# Altium schematic sheet 音乐频谱分析仪2014-11-17.SchDoc
size A
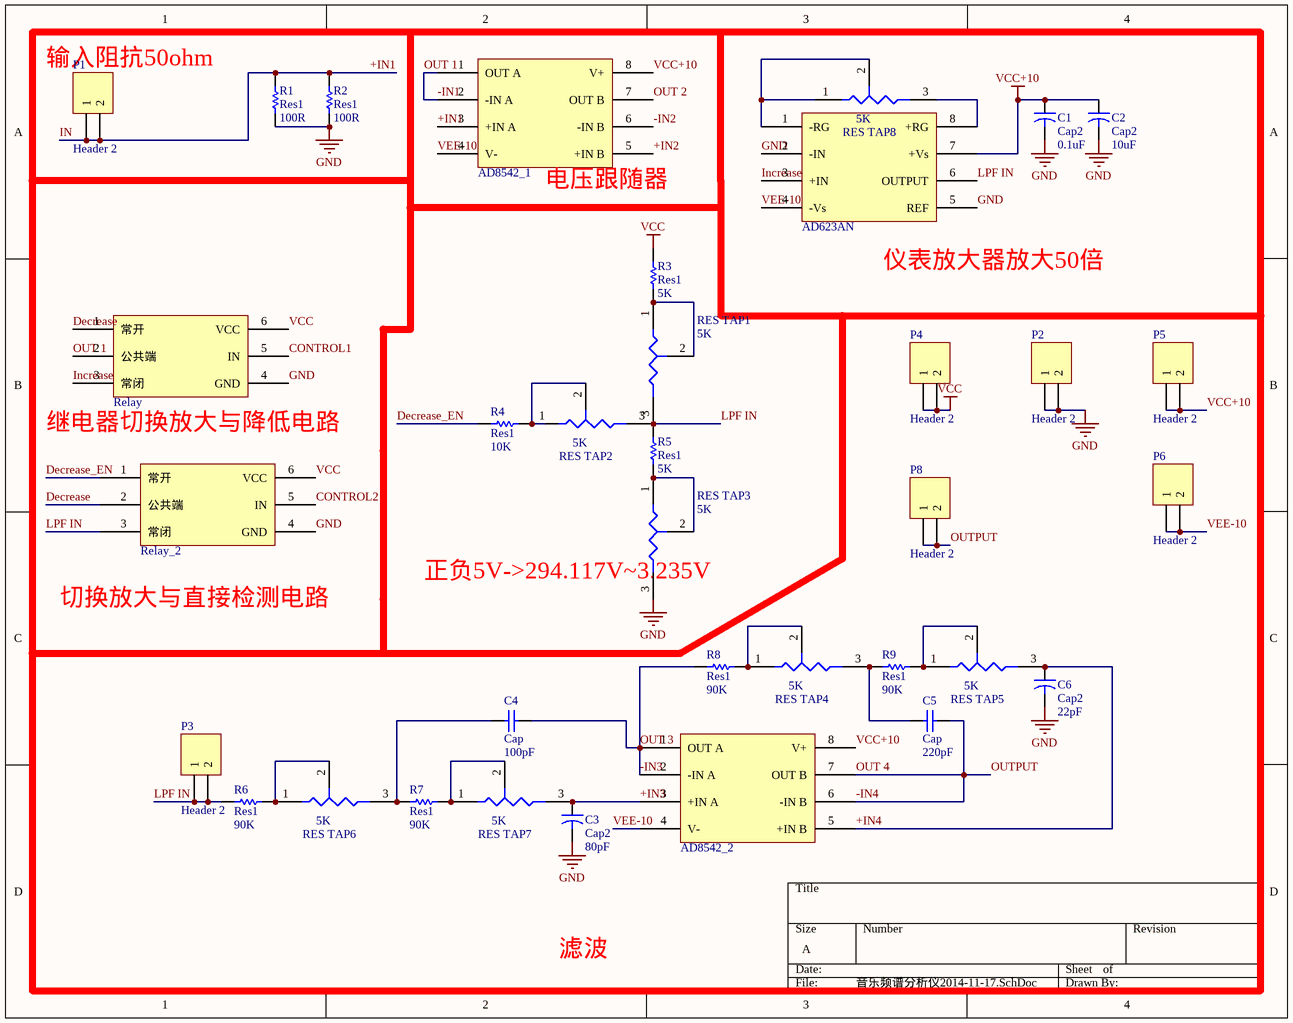
[diagram p0: 音乐频谱分析仪2014-11-17.SchDoc]

## Parts
AD623AN  AD623AN  [AD623AN]  (value not drawn)
AD8542_1  AD8542  [AD8542]  (value not drawn)
AD8542_2  AD8542  [AD8542]  (value not drawn)
C1  Cap2  value 0.1uF  [BAT-2]
C2  Cap2  value 10uF  [BAT-2]
C3  Cap2  value 80pF  [BAT-2]
C4  Cap  value 100pF  [BAT-2]
C5  Cap  value 220pF  [BAT-2]
C6  Cap2  value 22pF  [BAT-2]
P1  Header 2  [HDR1X2]
P2  Header 2  [HDR1X2]
P3  Header 2  [HDR1X2]
P4  Header 2  [HDR1X2]
P5  Header 2  [HDR1X2]
P6  Header 2  [HDR1X2]
P8  Header 2  [HDR1X2]
R1  Res1  value 100R  [AXIAL-0.3]
R2  Res1  value 100R  [AXIAL-0.3]
R3  Res1  value 5K  [AXIAL-0.3]
R4  Res1  value 10K  [AXIAL-0.3]
R5  Res1  value 5K  [AXIAL-0.3]
R6  Res1  value 90K  [AXIAL-0.3]
R7  Res1  value 90K  [AXIAL-0.3]
R8  Res1  value 90K  [AXIAL-0.3]
R9  Res1  value 90K  [AXIAL-0.3]
Relay  Relay  [Relay]  (value not drawn)
Relay_2  Relay  [Relay]  (value not drawn)
RES_TAP1  5K  [RES TAP2]
RES_TAP2  5K  [RES TAP2]
RES_TAP3  5K  [RES TAP2]
RES_TAP4  5K  [RES TAP2]
RES_TAP5  5K  [RES TAP2]
RES_TAP6  5K  [RES TAP2]
RES_TAP7  5K  [RES TAP2]
RES_TAP8  5K  [RES TAP2]

## Nets
GND: AD623AN.2(-IN) AD623AN.5(REF) C1.2 C2.2 C3.2 C6.2 P2.1 P2.2 R1.1 R2.1 Relay.4(GND) Relay_2.4(GND) RES_TAP3.3(B)
VCC: P4.1 P4.2 R3.2 Relay.6(VCC) Relay_2.6(VCC)
VCC+10: AD623AN.7(+Vs) AD8542_1.8(V+) AD8542_2.8(V+) C1.1 C2.1 P5.1 P5.2
+IN1: AD8542_1.3(+IN_A) P1.1 P1.2 R1.2 R2.2  [also labelled IN]
+IN2: AD8542_1.5(+IN_B)
+IN3: AD8542_2.3(+IN_A) C3.1 RES_TAP7.3(B)
+IN4: AD8542_2.5(+IN_B) C6.1 RES_TAP5.3(B)
-IN1: AD8542_1.1(OUT_A) AD8542_1.2(-IN_A) Relay.2(公共端)  [also labelled OUT 1]
-IN2: AD8542_1.6(-IN_B)
-IN3: AD8542_2.1(OUT_A) AD8542_2.2(-IN_A) C4.2 R8.2  [also labelled OUT 3]
-IN4: AD8542_2.6(-IN_B) AD8542_2.7(OUT_B) C5.2 P8.1 P8.2  [also labelled OUT 4, OUTPUT]
CONTROL1: Relay.5(IN)
CONTROL2: Relay_2.5(IN)
Decrease: Relay.1(常开) Relay_2.2(公共端)
Decrease_EN: R4.2 Relay_2.1(常开)
Increase: AD623AN.3(+IN) Relay.3(常闭)
LPF IN: AD623AN.6(OUTPUT) P3.1 P3.2 R5.2 R6.2 Relay_2.3(常闭) RES_TAP1.3(B) RES_TAP2.3(B)
OUT 2: AD8542_1.7(OUT_B)
VEE-10: AD623AN.4(-Vs) AD8542_1.4(V-) AD8542_2.4(V-) P6.1 P6.2
NetAD623AN_1: AD623AN.1(-RG) RES_TAP8.1(A) RES_TAP8.2(TAP)
NetAD623AN_8: AD623AN.8(+RG) RES_TAP8.3(B)
NetC4_1: C4.1 R7.2 RES_TAP6.3(B)
NetC5_1: C5.1 R9.2 RES_TAP4.3(B)
NetR3_1: R3.1 RES_TAP1.1(A) RES_TAP1.2(TAP)
NetR4_1: R4.1 RES_TAP2.1(A) RES_TAP2.2(TAP)
NetR5_1: R5.1 RES_TAP3.1(A) RES_TAP3.2(TAP)
NetR6_1: R6.1 RES_TAP6.1(A) RES_TAP6.2(TAP)
NetR7_1: R7.1 RES_TAP7.1(A) RES_TAP7.2(TAP)
NetR8_1: R8.1 RES_TAP4.1(A) RES_TAP4.2(TAP)
NetR9_1: R9.1 RES_TAP5.1(A) RES_TAP5.2(TAP)

## Notes on the sheet
- (near P1) 输入阻抗50ohm
- (near AD8542_1) 电压跟随器
- (near AD623AN) 仪表放大器放大50倍
- 继电器切换放大与降低电路
- 切换放大与直接检测电路
- (near RES_TAP3) 正负5V->294.117V~3.235V
- 滤波

## Library data of the parts
C1-C3 C6 = Cap2: Capacitor; Published: 23-Sep-2002; PackageReference: CAPR5-4X5; Publisher: Altium Limited; PackageDescription: Capacitor; 2 Leads
C4 C5 = Cap: Capacitor; Published: 8-Jun-2000; LatestRevisionDate: 17-Jul-2002; LatestRevisionNote: Re-released for DXP Platform.; PackageReference: RAD-0.3; Publisher: Altium Limited; PackageDescription: Radial Cap, Thru-Hole; 2 Leads; 0.3 in Pin Spacing
P1-P6 P8 = Header 2: Header, 2-Pin; LatestRevisionDate: 17-Jul-2002; LatestRevisionNote: Re-released for DXP Platform.; Publisher: Altium Limited
R1-R9 = Res1: Resistor; Published: 8-Jun-2000; LatestRevisionDate: 17-Jul-2002; LatestRevisionNote: Re-released for DXP Platform.; PackageReference: AXIAL-0.3; Publisher: Altium Limited; PackageDescription: Axial Device, Thru-Hole; 2 Leads; 0.3 in Pin Spacing
RES_TAP1-RES_TAP8 = RES TAP2